# EAGLE design motor (EAGLE 5.11)
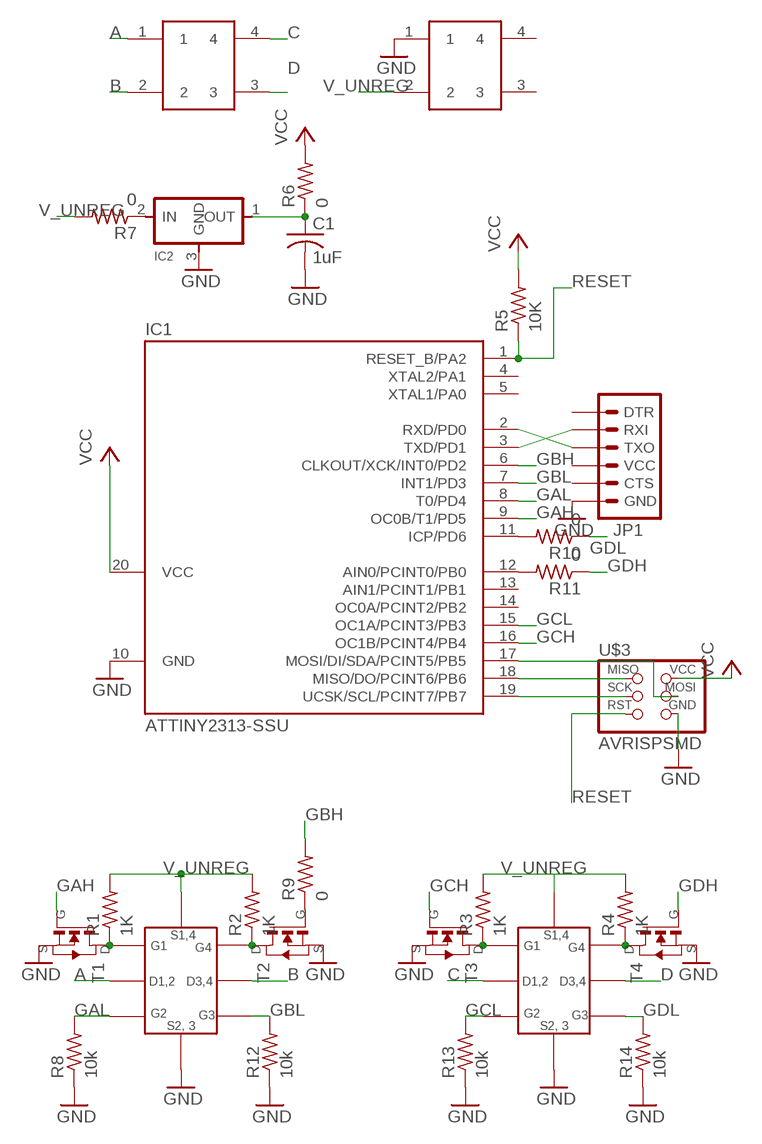
[diagram p0: schematic, sheet 1]

## Parts
C1  1uF  C-USC1206  [C1206]
IC1  ATTINY2313-SSU  [SOIC20]
IC2  REGULATORSOT23  [SOT23]
JP1  ARDUINO_SERIAL_PROGRAMSMD  [1X06-SMD]
R1  1K  R-US_R1206  [R1206]
R2  1K  R-US_R1206  [R1206]
R3  1K  R-US_R1206  [R1206]
R4  1K  R-US_R1206  [R1206]
R5  10K  R-US_R1206  [R1206]
R6  0  R-US_R1206  [R1206]
R7  0  R-US_R1206  [R1206]
R8  10k  R-US_R1206  [R1206]
R9  0  R-US_R1206  [R1206]
R10  0  R-US_R1206  [R1206]
R11  0  R-US_R1206  [R1206]
R12  10k  R-US_R1206  [R1206]
R13  10k  R-US_R1206  [R1206]
R14  10k  R-US_R1206  [R1206]
T1  NMOSFETSOT23  [SOT-23]
T2  NMOSFETSOT23  [SOT-23]
T3  NMOSFETSOT23  [SOT-23]
T4  NMOSFETSOT23  [SOT-23]
U$1  DUAL_H-BRIDGE  [SM-8]
U$2  DUAL_H-BRIDGE  [SM-8]
U$3  AVRISPSMD  [2X03SMD]
U$4  2X2_HEADER  [2X2_SMT]
U$5  2X2_HEADER  [2X2_SMT]

## Nets
A: U$1.8(D1,2) U$4.1
B: U$1.6(D3,4) U$4.2
C: U$2.8(D1,2) U$4.4
D: U$2.6(D3,4) U$4.3
GAH: IC1.9(OC0B/T1/PD5) T1.3(G)
GAL: IC1.8(T0/PD4) R8.2 U$1.3(G2)
GBH: IC1.6(CLKOUT/XCK/INT0/PD2) R9.2
GBL: IC1.7(INT1/PD3) R12.2 U$1.1(G3)
GCH: IC1.16(OC1B/PCINT4/PB4) T3.3(G)
GCL: IC1.15(OC1A/PCINT3/PB3) R13.2 U$2.3(G2)
GDH: R11.1 T4.3(G)
GDL: R10.1 R14.2 U$2.1(G3)
GND: C1.2 IC1.10(GND) IC2.3(GND) JP1.6(GND) R8.1 R12.1 R13.1 R14.1 T1.2(S) T2.2(S) T3.2(S) T4.2(S) U$1.2(S2,3) U$2.2(S2,3) U$3.6(GND) U$5.1
N$1: R2.1 T2.1(D) U$1.5(G4)
N$2: R1.1 T1.1(D) U$1.4(G1)
N$3: R3.1 T3.1(D) U$2.4(G1)
N$4: R4.1 T4.1(D) U$2.5(G4)
N$5: IC1.2(RXD/PD0) JP1.3(TXO)
N$6: IC1.18(MISO/DO/PCINT6/PB6) U$3.1(MISO)
N$7: IC1.19(UCSK/SCL/PCINT7/PB7) U$3.3(SCK)
N$8: IC1.17(MOSI/DI/SDA/PCINT5/PB5) U$3.4(MOSI)
N$9: IC1.3(TXD/PD1) JP1.2(RXI)
N$10: C1.1 IC2.1(OUT) R6.1
N$11: R9.1 T2.3(G)
N$12: IC1.11(ICP/PD6) R10.2
N$13: IC1.12(AIN0/PCINT0/PB0) R11.2
N$14: IC2.2(IN) R7.1
RESET: IC1.1(RESET_B/PA2) R5.1 U$3.5(RST)
V_UNREG: R1.2 R2.2 R3.2 R4.2 R7.2 U$1.7(S1,4) U$2.7(S1,4) U$5.2
VCC: IC1.20(VCC) R5.2 R6.2 U$3.2(VCC)
Unconnected: IC1.4(XTAL2/PA1) IC1.5(XTAL1/PA0) IC1.13(AIN1/PCINT1/PB1) IC1.14(OC0A/PCINT2/PB2) JP1.1(DTR) JP1.4(VCC) JP1.5(CTS) U$5.3 U$5.4

## Library data of the parts
C1 = rcl:C-US: CAPACITOR, American symbol
IC1 = mkfab:ATTINY2313
IC2 = fab:REGULATOR
JP1 = SparkFun:ARDUINO_SERIAL_PROGRAM
R1-R14 = rcl:R-US_: RESISTOR, American symbol
T1-T4 = fab:NMOSFET: MOS FET
U$1 U$2 = mkfab:DUAL_H-BRIDGE: MOSFET H-BRIDGE DUAL SM-8 DigiKey: ZXMHC3A01T8CT-ND
U$3 = fab:AVRISP
U$4 U$5 = mkfab:2X2_HEADER

## Board
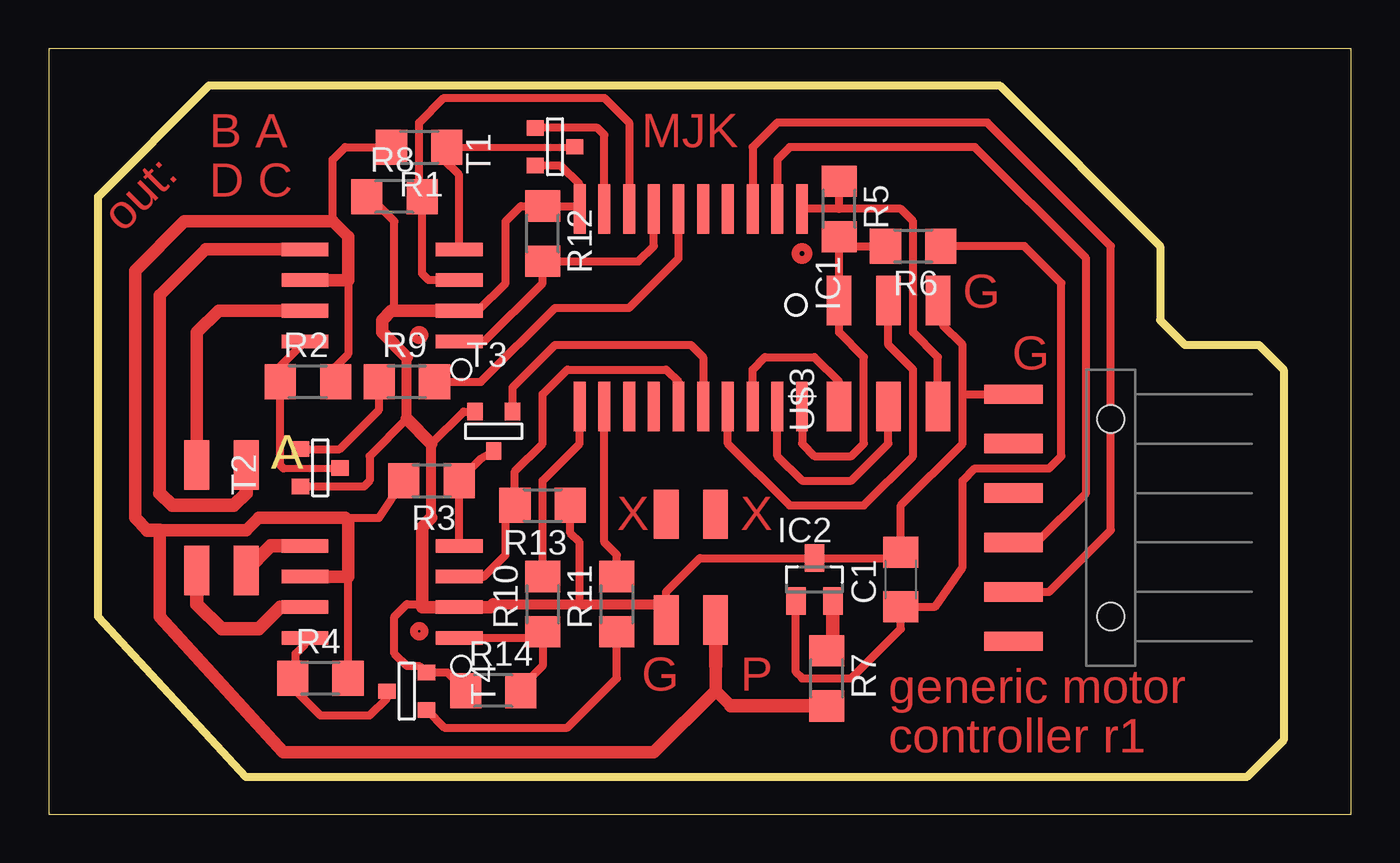
[diagram p1: board, top side]

Size 66.98 x 39.36 mm. Coordinates in mm from the lower left corner, seen from the top.
Outline: 0,0 66.98,0 66.98,39.36 0,39.36 0,0
Copper layers (1*16): Top 0.035mm / dielectric 1.5mm / Bottom 0.035mm
Design rules "fab": minimum track width 12mil, minimum drill 0.8mm, track to track 15.5mil, track to pad 15.5mil, pad to pad 15mil, via to via 15mil, smd to smd 10mil, copper to edge 0mil, drill to drill 1mm, minimum pad ring 0.2mm, minimum via ring 0.2mm, stop-mask expansion 4mil, vias tented up to drill 0mil, thermal gap 1mm
Milling: area 2.5,1.9 to 63.5,37.5

### Footprints (pad centres in the part's own frame; a part is rotated, then mirrored left to right if it is on the bottom)
C1206 = smd 1.6 x 1.8: 1 -1.4,0; 2 1.4,0
SOIC20 = smd 0.61 x 2.54: 1 -5.715,-5.08; 2 -4.445,-5.08; 3 -3.175,-5.08; 4 -1.905,-5.08; 5 -0.635,-5.08; 6 0.635,-5.08; 7 1.905,-5.08; 8 3.175,-5.08; 9 4.445,-5.08; 10 5.715,-5.08; 11 5.715,5.08; 12 4.445,5.08; 13 3.175,5.08; 14 1.905,5.08; 15 0.635,5.08; 16 -0.635,5.08; 17 -1.905,5.08; 18 -3.175,5.08; 19 -4.445,5.08; 20 -5.715,5.08
SOT23 = smd 1 x 1.4: 1 -0.95,-1.1; 2 0.95,-1.1; 3 0,1.1
1X06-SMD = smd 1 x 3: 1 -6.35,5; 2 -3.81,5; 3 -1.27,5; 4 1.27,5; 5 3.81,5; 6 6.35,5 | hole 1.4: -5.08,0; 5.08,0
R1206 = smd 1.6 x 1.803: 1 -1.422,0; 2 1.422,0
SOT-23 = smd 0.787 x 0.889: 1 0.025,-1.016; 2 -0.94,1.016; 3 0.991,1.016
SM-8 = smd 2.413 x 0.698: 1 -3.962,2.362; 2 -3.962,0.787; 3 -3.962,-0.787; 4 -3.962,-2.362; 5 3.962,2.362; 6 3.962,0.787; 7 3.962,-0.787; 8 3.962,-2.362
2X03SMD = smd 2.54 x 1.27: 1 -2.54,2.54; 2 2.92,2.54; 3 -2.54,0; 4 2.92,0; 5 -2.54,-2.54; 6 2.92,-2.54
2X2_SMT = smd 2.54 x 1.27: 1 -2.718,1.27; 2 -2.718,-1.27; 3 2.718,-1.27; 4 2.718,1.27

### Placement (x,y rotation side)
C1  43.81,12.06 90 top
IC1  33.02,26.04 180 top
IC2  39.37,12.06 0 top
JP1  54.61,15.24 90 top
R1  19.05,34.29 180 top
R2  13.34,22.23 0 top
R3  19.68,17.14 180 top
R4  13.97,6.98 0 top
R5  40.64,31.12 270 top
R6  44.45,29.21 180 top
R7  40.01,6.98 270 top
R8  17.78,31.75 0 top
R9  18.41,22.23 0 top
R10  25.4,10.79 90 top
R11  29.21,10.79 90 top
R12  25.4,29.84 270 top
R13  25.4,15.87 180 top
R14  22.86,6.35 0 top
T1  26.04,34.29 90 top
T2  13.97,17.78 90 top
T3  22.86,19.69 0 top
T4  18.41,6.35 270 top
U$1  17.14,26.67 180 top
U$2  17.14,11.43 180 top
U$3  43.18,23.5 90 top
U$4  8.89,15.24 270 top
U$5  33.02,12.7 90 top

### Tracks (layer width: path | path; a pad name or v marks a point on that pad's centre or on a via)
A
  Top 0.635: U$1.8 8.08,29.03 5.71,26.67 5.71,16.51
  Top 0.686: 5.71,16.51 6.35,15.87 9.52,15.87 10.16,16.51 U$4.1
B
  Top 0.635: U$4.2 7.62,24.77 8.74,25.88 U$1.6
C
  Top 0.686: U$2.8 11.43,13.79 U$4.4
D
  Top 0.686: U$2.6 11.91,10.64 10.8,9.53 8.89,9.53 7.62,10.79 U$4.3
GAH
  Top 0.406: T1.3 28.22,35.28 28.58,34.93 IC1.9
GAL
  Top 0.406: U$1.3 19.53,27.46 19.2,27.79 R8.2 19.2,32.38 19.05,32.54 19.05,35.56 20.32,36.83 28.58,36.83 29.84,35.56 IC1.8
GBH
  Top 0.406: R9.2 22.23,22.23 26.04,26.04 29.84,26.04 32.38,28.58 IC1.6
GBL
  Top 0.406: U$1.1 22.4,24.31 25.4,27.3 R12.2 30.33,28.42 31.12,29.21 IC1.7
GCH
  Top 0.406: IC1.16 33.66,23.5 33.02,24.13 26.04,24.13 23.85,21.95 T3.3
GCL
  Top 0.406: U$2.3 22.38,12.22 23.49,13.33 23.49,15.39 R13.2 23.98,17.63 25.4,19.05 25.4,21.59 26.67,22.86 31.75,22.86 32.38,22.23 IC1.15
GDH
  Top 0.406: R11.1 29.21,6.98 26.67,4.44 20.34,4.44 T4.3
GDL
  Top 0.406: R14.2 24.46,6.53 24.46,6.68 25.4,7.62 R10.1 25.09,9.07 U$2.1
GND
  Top 0.406: U$1.2 22.07,25.88 23.49,27.3 23.49,30.48 24.28,31.27 R12.1 27.15,31.27 IC1.10 27.3,32.38 26.34,33.35 T1.2 | U$3.6 45.98,26.41 45.98,25.15 46.99,24.13 46.99,21.59 | 31.75,10.16 31.75,10.79 31.75,11.43 33.48,13.17 IC2.3 | 31.75,10.16 U$5.1 31.57,10.16 | 43.81,13.97 C1.2 | 43.81,13.97 43.81,15.87 46.99,19.05 46.99,21.59 | IC2.3 43.01,13.17 43.81,13.97 | IC2.3 39.37,13.33 | R14.1 20.5,7.29 T4.2 19.2,7.52 19.15,7.52 19.05,7.62 18.41,7.62 17.78,8.26 17.78,10.16 18.41,10.79 19.2,10.79 | 19.68,19.1 19.68,19.05 21.34,20.7 T3.2 | R13.1 26.82,14.45 27.3,13.97 27.3,10.79 | R8.1 16.51,31.75 17.78,30.48 17.78,25.88 | 31.57,10.62 31.57,10.34 31.75,10.16 | 46.99,21.59 JP1.6 | T2.2 16.21,16.84 16.51,17.14 16.51,18.41 18.41,20.32
  Top 0.508: 19.68,15.24 19.68,19.05 | 18.41,20.32 18.41,23.5 | 22.86,10.79 27.3,10.79 31.75,10.79
  Top 0.571: 31.57,10.16 31.57,10.62 31.75,10.79
  Top 0.635: 22.86,10.79 22.71,10.64 U$2.2 19.2,10.64 19.2,10.79 19.2,14.76 19.68,15.24 | 19.68,19.05 18.41,20.32 | 18.41,23.5 17.14,24.77 17.14,25.4 17.63,25.88 17.78,25.88 U$1.2
N$1
  Top 0.356: 12.07,17.78 14.96,17.78
  Top 0.406: U$1.5 11.91,23.04 R2.1 11.91,17.93 12.07,17.78 | 14.96,17.78 T2.1
N$2
  Top 0.356: R1.1 27.03,34.29
  Top 0.406: 27.03,34.29 T1.1 | U$1.4 21.11,32.87 20.32,33.66 20.32,34.14 R1.1
N$3
  Top 0.406: U$2.4 21.11,16.51 R3.1 22.25,18.29 T3.1
N$4
  Top 0.406: T4.1 17.4,5.97 16.51,5.08 13.97,5.08 12.7,6.35 12.7,6.83 R4.1 12.7,7.14 12.7,8.26 13.18,8.74 U$2.5
N$5
  Top 0.406: IC1.2 37.47,33.66 38.1,34.29 47.62,34.29 53.34,28.58 53.34,16.51 50.8,13.97 JP1.3
N$6
  Top 0.406: U$3.1 40.64,22.23 39.37,23.5 36.83,23.5 36.2,22.86 IC1.18
N$7
  Top 0.406: U$3.3 43.18,19.05 41.27,17.14 38.73,17.14 37.47,18.41 IC1.19
N$8
  Top 0.406: IC1.17 34.92,19.05 38.1,15.87 41.91,15.87 44.45,18.41 44.45,22.86 43.18,24.13 U$3.4
N$9
  Top 0.406: JP1.2 51.44,11.43 54.61,14.6 54.61,29.21 48.26,35.56 37.47,35.56 36.2,34.29 IC1.3
N$10
  Top 0.406: C1.1 43.69,10.67 | C1.1 45.59,10.67 46.99,12.7 46.99,17.14 47.62,17.78 51.44,17.78 52.07,18.41 52.07,27.3 50.16,29.21 R6.1 | IC2.1 38.42,7.3 38.73,6.98 41.27,6.98 43.81,9.53 C1.1
N$11
  Top 0.406: 16.64,22.58 R9.1 16.99,20.8 14.96,18.77 T2.3
N$12
  Top 0.406: IC1.11 27.3,19.05 25.4,17.14 R10.2
N$13
  Top 0.406: R11.2 29.21,13.33 28.58,13.97 IC1.12
N$14
  Top 0.406: R7.1 40.32,8.72
  Top 0.686: 40.32,8.72 IC2.2
RESET
  Top 0.406: U$3.5 45.72,23.5 44.45,24.77 44.45,30.48 43.81,31.12 40.64,31.12 | 40.64,31.12 IC1.1 | 40.64,31.12 R5.1
V_UNREG
  Top 0.406: 15.39,12.22 R4.2 | 15.39,12.22 | R2.2 14.76,23.01 15.39,23.65 15.39,27.46 | 15.24,15.24 16.99,15.24 R3.2 | 14.61,30.48 14.61,33.66 15.24,34.29 R1.2
  Top 0.635: U$1.7 15.39,27.46 15.39,29.69 14.61,30.48 6.98,30.48 4.45,27.94 4.45,15.24 5.08,14.6 | U$2.7 15.39,12.22 15.39,15.09 15.24,15.24 10.8,15.24 10.16,14.6 5.71,14.6 5.71,10.16 12.07,3.17 31.12,3.17 34.29,6.35 | 34.29,6.35 34.29,7.62 | 34.29,6.35 35.08,5.56
  Top 0.686: 34.29,7.62 U$5.2 | 35.08,5.56 R7.2 | 5.71,14.6 5.08,14.6
VCC
  Top 0.406: IC1.20 38.73,19.05 39.37,18.41 41.27,18.41 41.91,19.05 41.91,23.5 40.64,24.77 U$3.2 R5.2 41.12,29.21 R6.2
(copper drawn outside any net)
  shapes: Top circle x3

### Text on the board
Top: B A | MJK | D C | out: | G | G | X | X | G | P | generic motor | controller r1
Milling: A | A